# Altium schematic sheet POWER.SchDoc
size A
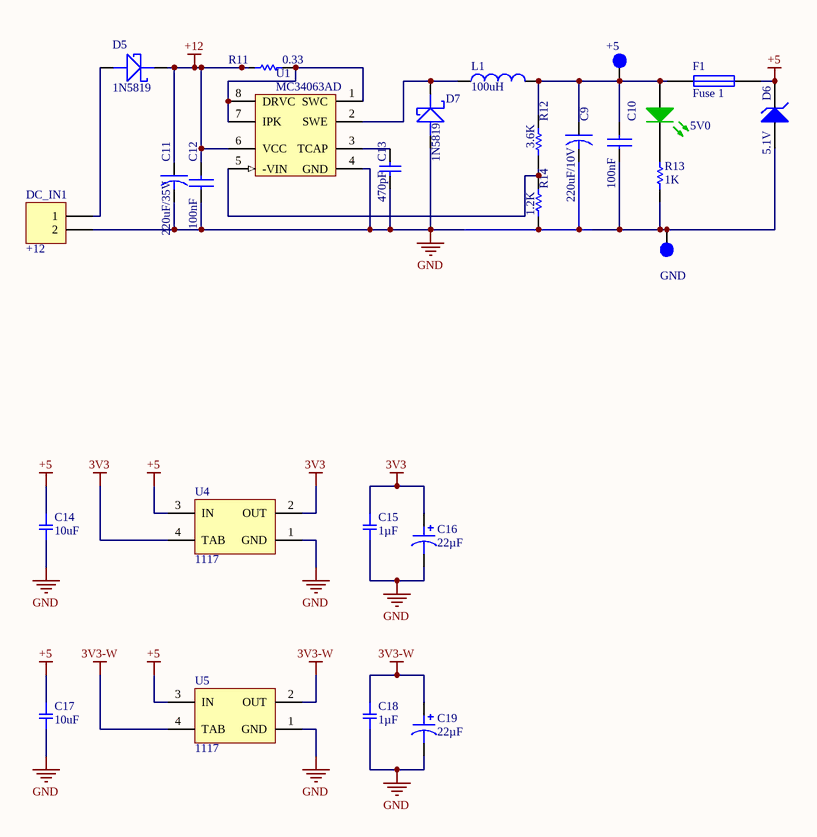
[diagram p0: POWER.SchDoc]

## Parts
5V0  LED-GREEN  [DIOSMD1206]  (value not drawn)
+5  Test Point  [PIN1]  (value not drawn)  (no BOM)
C9  220uF/10V  [Radial-B8]
C10  100nF  [0805]
C11  220uF/35V  [Radial-C10]
C12  100nF  [0805]
C13  470pF  [0805]
C14  10uF  [0805]
C15  1µF  [0805]
C16  22µF  [3216[1206]]
C17  10uF  [0805]
C18  1µF  [0805]
C19  22µF  [3216[1206]]
D5  1N5819  [DIODE-SMA]
D6  5.1V  [DIODE-SMA]
D7  1N5819  [DIODE-SMA]
DC_IN1  +12  [Phoenix_2]
F1  Fuse 1  [3216[1206]]
GND  Test Point  [PIN1]  (value not drawn)  (no BOM)
L1  100uH  [L_Right]
R11  0.33  [1206]
R12  3.6K  [0805]
R13  1K  [0805]
R14  1.2K  [0805]
U1  MC34063AD  [soic-8]
U4  1117  [SOT223]
U5  1117  [SOT223]

## Nets
3V3: C15.1 C16.1 U4.2(OUT) U4.4(TAB)
3V3-W: C18.1 C19.1 U5.2(OUT) U5.4(TAB)
+5: C14.1 C17.1 D6.2(K) F1.2 U4.3(IN) U5.3(IN)
+12: C11.1 C12.2 D5.2(K) R11.2 U1.6(VCC)
GND: C9.2 C10.1 C11.2 C12.1 C13.2 C14.2 C15.2 C16.2 C17.2 C18.2 C19.2 D6.1(A) D7.1(A) DC_IN1.2 GND.1 R13.2 R14.1 U1.4(GND) U4.1(GND) U5.1(GND)
Net5V0_1: 5V0.1(A) +5.1 C9.1 C10.2 F1.1 L1.2 R12.2
Net5V0_2: 5V0.2(K) R13.1
NetC13_1: C13.1 U1.3(TCAP)
NetD5_1: D5.1(A) DC_IN1.1
NetD7_2: D7.2(K) L1.1 U1.2(SWE)
NetR11_1: R11.1 U1.1(SWC) U1.7(IPK) U1.8(DRVC)
NetR12_1: R12.1 R14.2 U1.5(-VIN)

## Library data of the parts
5V0 = LED-GREEN: General Propuse Ga/As LED
+5 GND = Test Point: No PCB Compunent need; Signal: Voltage
C9 C11 = CAPACITOR: Electrolytic Capacitor
C10 C12 = C: 63V Multilayer
C13 = Cap: Capacitor; Value: 100pF; Published: 8-Jun-2000; LatestRevisionDate: 17-Jul-2002; LatestRevisionNote: Re-released for DXP Platform.; PackageReference: RAD-0.3; Publisher: Altium Limited
C14 C17 = GCM219R71C105KA37J: CAP CER 1.0UF 16V X7R 0805; Manufacturer: Murata Electronics North America; Factory Stock: 0; Unit Price (USD): 0.17; Minimum Quantity: 1; Value: 1µF; Tolerance: ±10%; Datasheets: http://www.murata.com/~/media/webrenewal/support/library/catalog/products/capacitor/mlcc/c03e.ashx; Image: //media.digikey.com/photos/Murata%20Photos/NCP,GCM%20SERIES%200805.jpg; Digi-Key Part Number: 490-12590-1-ND; Part Number: GCM219R71C105KA37J; Quantity Available: 7483; @ qty: 0; Packaging: Cut Tape (CT); Series: GCM; Part Status: Active; Voltage: 16V; Temperature Coefficient: X7R; Operating Temperature: -55°C ~ 125°C; Features: -; Ratings: AEC-Q200; Applications: Automotive; Mounting Type: Surface Mount, MLCC; Package / Case: 0805 (2012 Metric); Size / Dimension: 0.079" L x 0.049" W (2.00mm x 1.25mm); Height - Seated (Max): 0.037" (0.95mm); Thickness (Max): -; Lead Spacing: -
C15 C18 = GRM21BR71A105KA01K: CAP CER 1UF 10V X7R 0805; Manufacturer: Murata Electronics North America; Factory Stock: 0; Unit Price (USD): 0.11; Minimum Quantity: 1; Tolerance: ±10%; Datasheets: http://www.murata.com/~/media/webrenewal/support/library/catalog/products/capacitor/mlcc/c02e.pdf; Image: //media.digikey.com/Renders/Murata%20Renders/0805%20(2012%20Metric)%20.85mm.jpg; Digi-Key Part Number: 490-11595-1-ND; Part Number: GRM21BR71A105KA01K; Quantity Available: 16620; @ qty: 0; Packaging: Cut Tape (CT); Series: GRM; Part Status: Active; Value: 1µF; Voltage: 10V; Temperature Coefficient: X7R; Operating Temperature: -55°C ~ 125°C; Features: -; Ratings: -; Applications: General Purpose; Mounting Type: Surface Mount, MLCC; Package / Case: 0805 (2012 Metric); Size / Dimension: 0.079" L x 0.049" W (2.00mm x 1.25mm); Height - Seated (Max): -; Thickness (Max): 0.053" (1.35mm); Lead Spacing: -; Lead Style: -
C16 C19 = F931A226KAA: CAP TANT 22UF 10% 10V 1206; Manufacturer: AVX Corporation; Manufacturer Size Code: A; ESR (Equivalent Series Resistance): 2.5Ohm @ 100kHz; Lifetime @ Temp.: 2000 Hrs @ 125°C; Type: Molded; Part Number: F931A226KAA; Value: 22µF; Capacitance: 22µF; ComponentLink1Description: Datasheet; ComponentLink1URL: http://datasheets.avx.com/F93.pdf; ComponentLink2Description: DigiKey Link; ComponentLink2URL: http://digikey.com/product-detail/en/avx-corporation/F931A226KAA/478-8208-1-ND/4005605; Device Package: 1206 (3216 Metric); Features: General Purpose; Height - Seated (Max): 0.071" (1.80mm); LastUpdated: 1/21/2020 1:56:38 AM; Lifecycle Status: Active; Minimum Order: 1; Mounting Type: Surface Mount; Operating Temperature: -55°C ~ 125°C; Package / Case: 1206 (3216 Metric); Packaging: TapeAndReel; PartId: 182; Part Status: Active; Price: 0.14; Series: F93; Size / Dimension: 0.126" L x 0.063" W (3.20mm x 1.60mm); Supplier 1: DigiKey; Supplier Part Number 1: 478-8208-1-ND; Tolerance: ±10%; Voltage - Rated: 10V
D5 D7 = DIODE SCHOTTKY: Schottky Diode
D6 = D Zener: Zener Diode; Published: 8-Jun-2000; LatestRevisionDate: 17-Jul-2002; LatestRevisionNote: Re-released for DXP Platform.; PackageReference: DIODE-0.7; Publisher: Altium Limited; PackageDescription: Diode, Thru-Hole; 2 Leads; 0.7 in Pin Spacing
DC_IN1 = Header 2: Header, 2-Pin; LatestRevisionDate: 17-Jul-2002; LatestRevisionNote: Re-released for DXP Platform.; Publisher: Altium Limited
F1 = Fuse 1: Fuse; Published: 8-Jun-2000; LatestRevisionDate: 17-Jul-2002; LatestRevisionNote: Re-released for DXP Platform.; PackageReference: PIN-W2/E2.8; Publisher: Altium Limited; PackageDescription: Thru-Hole; 2 Leads
L1 = INDUCTOR
R11 = Res1: Resistor; Published: 8-Jun-2000; LatestRevisionDate: 17-Jul-2002; LatestRevisionNote: Re-released for DXP Platform.; PackageReference: AXIAL-0.3; Publisher: Altium Limited; Value: 0.33
R12 = Res1: Resistor; Value: 1.2K; Published: 8-Jun-2000; LatestRevisionDate: 17-Jul-2002; LatestRevisionNote: Re-released for DXP Platform.; PackageReference: AXIAL-0.3; Publisher: Altium Limited
R13 = 1-ResistorW: Resistor
R14 = Res1: Resistor; Value: ?K; Published: 8-Jun-2000; LatestRevisionDate: 17-Jul-2002; LatestRevisionNote: Re-released for DXP Platform.; PackageReference: AXIAL-0.3; Publisher: Altium Limited
U1 = MC34063AD: DC-to-DC Converter Control Circuit; Published: 17-Jul-2002; LatestRevisionDate: 13-Apr-2006; LatestRevisionNote: IPC-7351 Footprint Added.; DatasheetVersion: 1988; PackageReference: 751-02; Publisher: Altium Limited; PackageDescription: 8-Pin Small Outline Integrated Circuit 1.27 mm Pitch; Code_JEDEC: MS-012-AA; Code_IPC: SOIC127P600-8; ComponentLink1Description: Manufacturer Link; ComponentLink1URL: http://www.onsemi.com/site/products/taxonomy/0,4438,503,00.html; ComponentLink2Description: Datasheet; ComponentLink2URL: http://www.onsemi.com/pub/Collateral/MC34063A-D.PDF
U4 U5 = AMS1117-x.x: x.x Volt, 800mA Low-Dropout Linear Regulator, 4-pin SOT-223; Designer: Ali Hafizi; Data: 16-12-2016